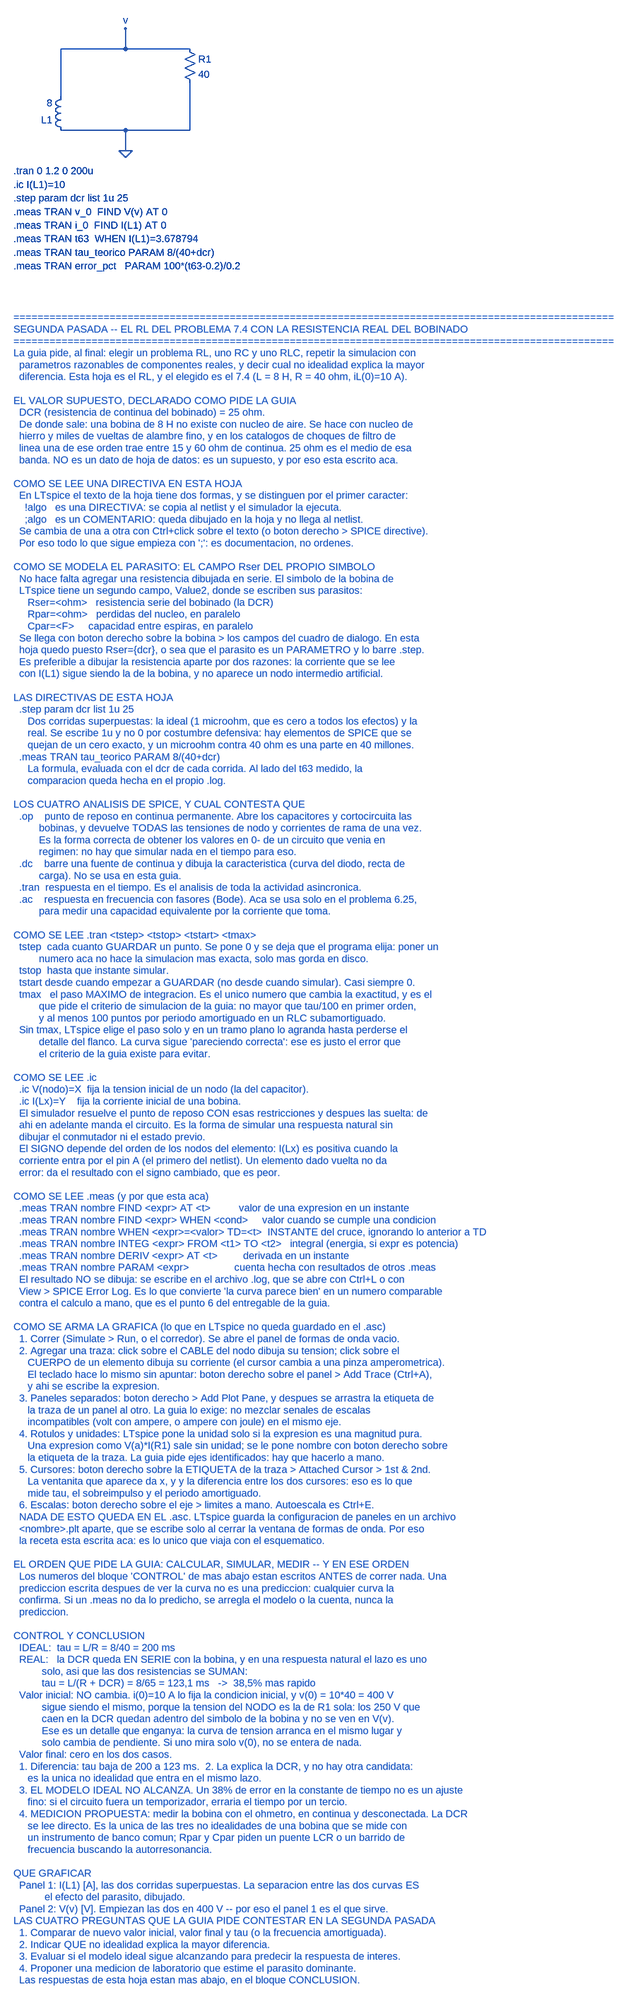
[diagram p0: schematic X1_no_ideal_RL_con_DCR.asc]
X1_no_ideal_RL_con_DCR.asc, the LTspice schematic file:
Version 4
SHEET 1 2200 2800
WIRE 176 224 176 112
WIRE 480 192 480 304
WIRE 176 112 480 112
WIRE 176 304 480 304
WIRE 328 304 328 352
WIRE 328 112 328 64
FLAG 328 352 0
FLAG 328 64 v
SYMBOL ind 192 320 R180
SYMATTR InstName L1
SYMATTR Value 8
SYMATTR Value2 Rser={dcr}
SYMBOL res 464 96 R0
SYMATTR InstName R1
SYMATTR Value 40
TEXT 64 400 Left 2 !.tran 0 1.2 0 200u
TEXT 64 432 Left 2 !.ic I(L1)=10
TEXT 64 464 Left 2 !.step param dcr list 1u 25
TEXT 64 496 Left 2 !.meas TRAN v_0  FIND V(v) AT 0
TEXT 64 528 Left 2 !.meas TRAN i_0  FIND I(L1) AT 0
TEXT 64 560 Left 2 !.meas TRAN t63  WHEN I(L1)=3.678794
TEXT 64 592 Left 2 !.meas TRAN tau_teorico PARAM 8/(40+dcr)
TEXT 64 624 Left 2 !.meas TRAN error_pct   PARAM 100*(t63-0.2)/0.2
TEXT 64 900 Left 2 ;====================================================================================================
TEXT 64 928 Left 2 ;SEGUNDA PASADA -- EL RL DEL PROBLEMA 7.4 CON LA RESISTENCIA REAL DEL BOBINADO
TEXT 64 956 Left 2 ;====================================================================================================
TEXT 64 984 Left 2 ;La guia pide, al final: elegir un problema RL, uno RC y uno RLC, repetir la simulacion con
TEXT 64 1012 Left 2 ;  parametros razonables de componentes reales, y decir cual no idealidad explica la mayor
TEXT 64 1040 Left 2 ;  diferencia. Esta hoja es el RL, y el elegido es el 7.4 (L = 8 H, R = 40 ohm, iL(0)=10 A).
TEXT 64 1068 Left 2 ;
TEXT 64 1096 Left 2 ;EL VALOR SUPUESTO, DECLARADO COMO PIDE LA GUIA
TEXT 64 1124 Left 2 ;  DCR (resistencia de continua del bobinado) = 25 ohm.
TEXT 64 1152 Left 2 ;  De donde sale: una bobina de 8 H no existe con nucleo de aire. Se hace con nucleo de
TEXT 64 1180 Left 2 ;  hierro y miles de vueltas de alambre fino, y en los catalogos de choques de filtro de
TEXT 64 1208 Left 2 ;  linea una de ese orden trae entre 15 y 60 ohm de continua. 25 ohm es el medio de esa
TEXT 64 1236 Left 2 ;  banda. NO es un dato de hoja de datos: es un supuesto, y por eso esta escrito aca.
TEXT 64 1264 Left 2 ;
TEXT 64 1292 Left 2 ;COMO SE LEE UNA DIRECTIVA EN ESTA HOJA
TEXT 64 1320 Left 2 ;  En LTspice el texto de la hoja tiene dos formas, y se distinguen por el primer caracter:
TEXT 64 1348 Left 2 ;    !algo   es una DIRECTIVA: se copia al netlist y el simulador la ejecuta.
TEXT 64 1376 Left 2 ;    ;algo   es un COMENTARIO: queda dibujado en la hoja y no llega al netlist.
TEXT 64 1404 Left 2 ;  Se cambia de una a otra con Ctrl+click sobre el texto (o boton derecho > SPICE directive).
TEXT 64 1432 Left 2 ;  Por eso todo lo que sigue empieza con ';': es documentacion, no ordenes.
TEXT 64 1460 Left 2 ;
TEXT 64 1488 Left 2 ;COMO SE MODELA EL PARASITO: EL CAMPO Rser DEL PROPIO SIMBOLO
TEXT 64 1516 Left 2 ;  No hace falta agregar una resistencia dibujada en serie. El simbolo de la bobina de
TEXT 64 1544 Left 2 ;  LTspice tiene un segundo campo, Value2, donde se escriben sus parasitos:
TEXT 64 1572 Left 2 ;     Rser=<ohm>   resistencia serie del bobinado (la DCR)
TEXT 64 1600 Left 2 ;     Rpar=<ohm>   perdidas del nucleo, en paralelo
TEXT 64 1628 Left 2 ;     Cpar=<F>     capacidad entre espiras, en paralelo
TEXT 64 1656 Left 2 ;  Se llega con boton derecho sobre la bobina > los campos del cuadro de dialogo. En esta
TEXT 64 1684 Left 2 ;  hoja quedo puesto Rser={dcr}, o sea que el parasito es un PARAMETRO y lo barre .step.
TEXT 64 1712 Left 2 ;  Es preferible a dibujar la resistencia aparte por dos razones: la corriente que se lee
TEXT 64 1740 Left 2 ;  con I(L1) sigue siendo la de la bobina, y no aparece un nodo intermedio artificial.
TEXT 64 1768 Left 2 ;
TEXT 64 1796 Left 2 ;LAS DIRECTIVAS DE ESTA HOJA
TEXT 64 1824 Left 2 ;  .step param dcr list 1u 25
TEXT 64 1852 Left 2 ;     Dos corridas superpuestas: la ideal (1 microohm, que es cero a todos los efectos) y la
TEXT 64 1880 Left 2 ;     real. Se escribe 1u y no 0 por costumbre defensiva: hay elementos de SPICE que se
TEXT 64 1908 Left 2 ;     quejan de un cero exacto, y un microohm contra 40 ohm es una parte en 40 millones.
TEXT 64 1936 Left 2 ;  .meas TRAN tau_teorico PARAM 8/(40+dcr)
TEXT 64 1964 Left 2 ;     La formula, evaluada con el dcr de cada corrida. Al lado del t63 medido, la
TEXT 64 1992 Left 2 ;     comparacion queda hecha en el propio .log.
TEXT 64 2020 Left 2 ;
TEXT 64 2048 Left 2 ;LOS CUATRO ANALISIS DE SPICE, Y CUAL CONTESTA QUE
TEXT 64 2076 Left 2 ;  .op    punto de reposo en continua permanente. Abre los capacitores y cortocircuita las
TEXT 64 2104 Left 2 ;         bobinas, y devuelve TODAS las tensiones de nodo y corrientes de rama de una vez.
TEXT 64 2132 Left 2 ;         Es la forma correcta de obtener los valores en 0- de un circuito que venia en
TEXT 64 2160 Left 2 ;         regimen: no hay que simular nada en el tiempo para eso.
TEXT 64 2188 Left 2 ;  .dc    barre una fuente de continua y dibuja la caracteristica (curva del diodo, recta de
TEXT 64 2216 Left 2 ;         carga). No se usa en esta guia.
TEXT 64 2244 Left 2 ;  .tran  respuesta en el tiempo. Es el analisis de toda la actividad asincronica.
TEXT 64 2272 Left 2 ;  .ac    respuesta en frecuencia con fasores (Bode). Aca se usa solo en el problema 6.25,
TEXT 64 2300 Left 2 ;         para medir una capacidad equivalente por la corriente que toma.
TEXT 64 2328 Left 2 ;
TEXT 64 2356 Left 2 ;COMO SE LEE .tran <tstep> <tstop> <tstart> <tmax>
TEXT 64 2384 Left 2 ;  tstep  cada cuanto GUARDAR un punto. Se pone 0 y se deja que el programa elija: poner un
TEXT 64 2412 Left 2 ;         numero aca no hace la simulacion mas exacta, solo mas gorda en disco.
TEXT 64 2440 Left 2 ;  tstop  hasta que instante simular.
TEXT 64 2468 Left 2 ;  tstart desde cuando empezar a GUARDAR (no desde cuando simular). Casi siempre 0.
TEXT 64 2496 Left 2 ;  tmax   el paso MAXIMO de integracion. Es el unico numero que cambia la exactitud, y es el
TEXT 64 2524 Left 2 ;         que pide el criterio de simulacion de la guia: no mayor que tau/100 en primer orden,
TEXT 64 2552 Left 2 ;         y al menos 100 puntos por periodo amortiguado en un RLC subamortiguado.
TEXT 64 2580 Left 2 ;  Sin tmax, LTspice elige el paso solo y en un tramo plano lo agranda hasta perderse el
TEXT 64 2608 Left 2 ;         detalle del flanco. La curva sigue 'pareciendo correcta': ese es justo el error que
TEXT 64 2636 Left 2 ;         el criterio de la guia existe para evitar.
TEXT 64 2664 Left 2 ;
TEXT 64 2692 Left 2 ;COMO SE LEE .ic
TEXT 64 2720 Left 2 ;  .ic V(nodo)=X  fija la tension inicial de un nodo (la del capacitor).
TEXT 64 2748 Left 2 ;  .ic I(Lx)=Y    fija la corriente inicial de una bobina.
TEXT 64 2776 Left 2 ;  El simulador resuelve el punto de reposo CON esas restricciones y despues las suelta: de
TEXT 64 2804 Left 2 ;  ahi en adelante manda el circuito. Es la forma de simular una respuesta natural sin
TEXT 64 2832 Left 2 ;  dibujar el conmutador ni el estado previo.
TEXT 64 2860 Left 2 ;  El SIGNO depende del orden de los nodos del elemento: I(Lx) es positiva cuando la
TEXT 64 2888 Left 2 ;  corriente entra por el pin A (el primero del netlist). Un elemento dado vuelta no da
TEXT 64 2916 Left 2 ;  error: da el resultado con el signo cambiado, que es peor.
TEXT 64 2944 Left 2 ;
TEXT 64 2972 Left 2 ;COMO SE LEE .meas (y por que esta aca)
TEXT 64 3000 Left 2 ;  .meas TRAN nombre FIND <expr> AT <t>          valor de una expresion en un instante
TEXT 64 3028 Left 2 ;  .meas TRAN nombre FIND <expr> WHEN <cond>     valor cuando se cumple una condicion
TEXT 64 3056 Left 2 ;  .meas TRAN nombre WHEN <expr>=<valor> TD=<t>  INSTANTE del cruce, ignorando lo anterior a TD
TEXT 64 3084 Left 2 ;  .meas TRAN nombre INTEG <expr> FROM <t1> TO <t2>   integral (energia, si expr es potencia)
TEXT 64 3112 Left 2 ;  .meas TRAN nombre DERIV <expr> AT <t>         derivada en un instante
TEXT 64 3140 Left 2 ;  .meas TRAN nombre PARAM <expr>                cuenta hecha con resultados de otros .meas
TEXT 64 3168 Left 2 ;  El resultado NO se dibuja: se escribe en el archivo .log, que se abre con Ctrl+L o con
TEXT 64 3196 Left 2 ;  View > SPICE Error Log. Es lo que convierte 'la curva parece bien' en un numero comparable
TEXT 64 3224 Left 2 ;  contra el calculo a mano, que es el punto 6 del entregable de la guia.
TEXT 64 3252 Left 2 ;
TEXT 64 3280 Left 2 ;COMO SE ARMA LA GRAFICA (lo que en LTspice no queda guardado en el .asc)
TEXT 64 3308 Left 2 ;  1. Correr (Simulate > Run, o el corredor). Se abre el panel de formas de onda vacio.
TEXT 64 3336 Left 2 ;  2. Agregar una traza: click sobre el CABLE del nodo dibuja su tension; click sobre el
TEXT 64 3364 Left 2 ;     CUERPO de un elemento dibuja su corriente (el cursor cambia a una pinza amperometrica).
TEXT 64 3392 Left 2 ;     El teclado hace lo mismo sin apuntar: boton derecho sobre el panel > Add Trace (Ctrl+A),
TEXT 64 3420 Left 2 ;     y ahi se escribe la expresion.
TEXT 64 3448 Left 2 ;  3. Paneles separados: boton derecho > Add Plot Pane, y despues se arrastra la etiqueta de
TEXT 64 3476 Left 2 ;     la traza de un panel al otro. La guia lo exige: no mezclar senales de escalas
TEXT 64 3504 Left 2 ;     incompatibles (volt con ampere, o ampere con joule) en el mismo eje.
TEXT 64 3532 Left 2 ;  4. Rotulos y unidades: LTspice pone la unidad solo si la expresion es una magnitud pura.
TEXT 64 3560 Left 2 ;     Una expresion como V(a)*I(R1) sale sin unidad; se le pone nombre con boton derecho sobre
TEXT 64 3588 Left 2 ;     la etiqueta de la traza. La guia pide ejes identificados: hay que hacerlo a mano.
TEXT 64 3616 Left 2 ;  5. Cursores: boton derecho sobre la ETIQUETA de la traza > Attached Cursor > 1st & 2nd.
TEXT 64 3644 Left 2 ;     La ventanita que aparece da x, y y la diferencia entre los dos cursores: eso es lo que
TEXT 64 3672 Left 2 ;     mide tau, el sobreimpulso y el periodo amortiguado.
TEXT 64 3700 Left 2 ;  6. Escalas: boton derecho sobre el eje > limites a mano. Autoescala es Ctrl+E.
TEXT 64 3728 Left 2 ;  NADA DE ESTO QUEDA EN EL .asc. LTspice guarda la configuracion de paneles en un archivo
TEXT 64 3756 Left 2 ;  <nombre>.plt aparte, que se escribe solo al cerrar la ventana de formas de onda. Por eso
TEXT 64 3784 Left 2 ;  la receta esta escrita aca: es lo unico que viaja con el esquematico.
TEXT 64 3812 Left 2 ;
TEXT 64 3840 Left 2 ;EL ORDEN QUE PIDE LA GUIA: CALCULAR, SIMULAR, MEDIR -- Y EN ESE ORDEN
TEXT 64 3868 Left 2 ;  Los numeros del bloque 'CONTROL' de mas abajo estan escritos ANTES de correr nada. Una
TEXT 64 3896 Left 2 ;  prediccion escrita despues de ver la curva no es una prediccion: cualquier curva la
TEXT 64 3924 Left 2 ;  confirma. Si un .meas no da lo predicho, se arregla el modelo o la cuenta, nunca la
TEXT 64 3952 Left 2 ;  prediccion.
TEXT 64 3980 Left 2 ;
TEXT 64 4008 Left 2 ;CONTROL Y CONCLUSION
TEXT 64 4036 Left 2 ;  IDEAL:  tau = L/R = 8/40 = 200 ms
TEXT 64 4064 Left 2 ;  REAL:   la DCR queda EN SERIE con la bobina, y en una respuesta natural el lazo es uno
TEXT 64 4092 Left 2 ;          solo, asi que las dos resistencias se SUMAN:
TEXT 64 4120 Left 2 ;          tau = L/(R + DCR) = 8/65 = 123,1 ms   ->  38,5% mas rapido
TEXT 64 4148 Left 2 ;  Valor inicial: NO cambia. i(0)=10 A lo fija la condicion inicial, y v(0) = 10*40 = 400 V
TEXT 64 4176 Left 2 ;          sigue siendo el mismo, porque la tension del NODO es la de R1 sola: los 250 V que
TEXT 64 4204 Left 2 ;          caen en la DCR quedan adentro del simbolo de la bobina y no se ven en V(v).
TEXT 64 4232 Left 2 ;          Ese es un detalle que enganya: la curva de tension arranca en el mismo lugar y
TEXT 64 4260 Left 2 ;          solo cambia de pendiente. Si uno mira solo v(0), no se entera de nada.
TEXT 64 4288 Left 2 ;  Valor final: cero en los dos casos.
TEXT 64 4316 Left 2 ;  1. Diferencia: tau baja de 200 a 123 ms.  2. La explica la DCR, y no hay otra candidata:
TEXT 64 4344 Left 2 ;     es la unica no idealidad que entra en el mismo lazo.
TEXT 64 4372 Left 2 ;  3. EL MODELO IDEAL NO ALCANZA. Un 38% de error en la constante de tiempo no es un ajuste
TEXT 64 4400 Left 2 ;     fino: si el circuito fuera un temporizador, erraria el tiempo por un tercio.
TEXT 64 4428 Left 2 ;  4. MEDICION PROPUESTA: medir la bobina con el ohmetro, en continua y desconectada. La DCR
TEXT 64 4456 Left 2 ;     se lee directo. Es la unica de las tres no idealidades de una bobina que se mide con
TEXT 64 4484 Left 2 ;     un instrumento de banco comun; Rpar y Cpar piden un puente LCR o un barrido de
TEXT 64 4512 Left 2 ;     frecuencia buscando la autorresonancia.
TEXT 64 4540 Left 2 ;
TEXT 64 4568 Left 2 ;QUE GRAFICAR
TEXT 64 4596 Left 2 ;  Panel 1: I(L1) [A], las dos corridas superpuestas. La separacion entre las dos curvas ES
TEXT 64 4624 Left 2 ;           el efecto del parasito, dibujado.
TEXT 64 4652 Left 2 ;  Panel 2: V(v) [V]. Empiezan las dos en 400 V -- por eso el panel 1 es el que sirve.
TEXT 64 4680 Left 2 ;LAS CUATRO PREGUNTAS QUE LA GUIA PIDE CONTESTAR EN LA SEGUNDA PASADA
TEXT 64 4708 Left 2 ;  1. Comparar de nuevo valor inicial, valor final y tau (o la frecuencia amortiguada).
TEXT 64 4736 Left 2 ;  2. Indicar QUE no idealidad explica la mayor diferencia.
TEXT 64 4764 Left 2 ;  3. Evaluar si el modelo ideal sigue alcanzando para predecir la respuesta de interes.
TEXT 64 4792 Left 2 ;  4. Proponer una medicion de laboratorio que estime el parasito dominante.
TEXT 64 4820 Left 2 ;  Las respuestas de esta hoja estan mas abajo, en el bloque CONCLUSION.

The netlist it stands for:
* X1_no_ideal_RL_con_DCR.asc
L1 0 v 8 Rser={dcr}
R1 v 0 40
.tran 0 1.2 0 200u
.ic I(L1)=10
.step param dcr list 1u 25
.meas TRAN v_0  FIND V(v) AT 0
.meas TRAN i_0  FIND I(L1) AT 0
.meas TRAN t63  WHEN I(L1)=3.678794
.meas TRAN tau_teorico PARAM 8/(40+dcr)
.meas TRAN error_pct   PARAM 100*(t63-0.2)/0.2
* ====================================================================================================
* SEGUNDA PASADA -- EL RL DEL PROBLEMA 7.4 CON LA RESISTENCIA REAL DEL BOBINADO
* ====================================================================================================
* La guia pide, al final: elegir un problema RL, uno RC y uno RLC, repetir la simulacion con
*   parametros razonables de componentes reales, y decir cual no idealidad explica la mayor
*   diferencia. Esta hoja es el RL, y el elegido es el 7.4 (L = 8 H, R = 40 ohm, iL(0)=10 A).
* EL VALOR SUPUESTO, DECLARADO COMO PIDE LA GUIA
*   DCR (resistencia de continua del bobinado) = 25 ohm.
*   De donde sale: una bobina de 8 H no existe con nucleo de aire. Se hace con nucleo de
*   hierro y miles de vueltas de alambre fino, y en los catalogos de choques de filtro de
*   linea una de ese orden trae entre 15 y 60 ohm de continua. 25 ohm es el medio de esa
*   banda. NO es un dato de hoja de datos: es un supuesto, y por eso esta escrito aca.
* COMO SE LEE UNA DIRECTIVA EN ESTA HOJA
*   En LTspice el texto de la hoja tiene dos formas, y se distinguen por el primer caracter:
*     !algo   es una DIRECTIVA: se copia al netlist y el simulador la ejecuta.
*     ;algo   es un COMENTARIO: queda dibujado en la hoja y no llega al netlist.
*   Se cambia de una a otra con Ctrl+click sobre el texto (o boton derecho > SPICE directive).
*   Por eso todo lo que sigue empieza con ';': es documentacion, no ordenes.
* COMO SE MODELA EL PARASITO: EL CAMPO Rser DEL PROPIO SIMBOLO
*   No hace falta agregar una resistencia dibujada en serie. El simbolo de la bobina de
*   LTspice tiene un segundo campo, Value2, donde se escriben sus parasitos:
*      Rser=<ohm>   resistencia serie del bobinado (la DCR)
*      Rpar=<ohm>   perdidas del nucleo, en paralelo
*      Cpar=<F>     capacidad entre espiras, en paralelo
*   Se llega con boton derecho sobre la bobina > los campos del cuadro de dialogo. En esta
*   hoja quedo puesto Rser={dcr}, o sea que el parasito es un PARAMETRO y lo barre .step.
*   Es preferible a dibujar la resistencia aparte por dos razones: la corriente que se lee
*   con I(L1) sigue siendo la de la bobina, y no aparece un nodo intermedio artificial.
* LAS DIRECTIVAS DE ESTA HOJA
*   .step param dcr list 1u 25
*      Dos corridas superpuestas: la ideal (1 microohm, que es cero a todos los efectos) y la
*      real. Se escribe 1u y no 0 por costumbre defensiva: hay elementos de SPICE que se
*      quejan de un cero exacto, y un microohm contra 40 ohm es una parte en 40 millones.
*   .meas TRAN tau_teorico PARAM 8/(40+dcr)
*      La formula, evaluada con el dcr de cada corrida. Al lado del t63 medido, la
*      comparacion queda hecha en el propio .log.
* LOS CUATRO ANALISIS DE SPICE, Y CUAL CONTESTA QUE
*   .op    punto de reposo en continua permanente. Abre los capacitores y cortocircuita las
*          bobinas, y devuelve TODAS las tensiones de nodo y corrientes de rama de una vez.
*          Es la forma correcta de obtener los valores en 0- de un circuito que venia en
*          regimen: no hay que simular nada en el tiempo para eso.
*   .dc    barre una fuente de continua y dibuja la caracteristica (curva del diodo, recta de
*          carga). No se usa en esta guia.
*   .tran  respuesta en el tiempo. Es el analisis de toda la actividad asincronica.
*   .ac    respuesta en frecuencia con fasores (Bode). Aca se usa solo en el problema 6.25,
*          para medir una capacidad equivalente por la corriente que toma.
* COMO SE LEE .tran <tstep> <tstop> <tstart> <tmax>
*   tstep  cada cuanto GUARDAR un punto. Se pone 0 y se deja que el programa elija: poner un
*          numero aca no hace la simulacion mas exacta, solo mas gorda en disco.
*   tstop  hasta que instante simular.
*   tstart desde cuando empezar a GUARDAR (no desde cuando simular). Casi siempre 0.
*   tmax   el paso MAXIMO de integracion. Es el unico numero que cambia la exactitud, y es el
*          que pide el criterio de simulacion de la guia: no mayor que tau/100 en primer orden,
*          y al menos 100 puntos por periodo amortiguado en un RLC subamortiguado.
*   Sin tmax, LTspice elige el paso solo y en un tramo plano lo agranda hasta perderse el
*          detalle del flanco. La curva sigue 'pareciendo correcta': ese es justo el error que
*          el criterio de la guia existe para evitar.
* COMO SE LEE .ic
*   .ic V(nodo)=X  fija la tension inicial de un nodo (la del capacitor).
*   .ic I(Lx)=Y    fija la corriente inicial de una bobina.
*   El simulador resuelve el punto de reposo CON esas restricciones y despues las suelta: de
*   ahi en adelante manda el circuito. Es la forma de simular una respuesta natural sin
*   dibujar el conmutador ni el estado previo.
*   El SIGNO depende del orden de los nodos del elemento: I(Lx) es positiva cuando la
*   corriente entra por el pin A (el primero del netlist). Un elemento dado vuelta no da
*   error: da el resultado con el signo cambiado, que es peor.
* COMO SE LEE .meas (y por que esta aca)
*   .meas TRAN nombre FIND <expr> AT <t>          valor de una expresion en un instante
*   .meas TRAN nombre FIND <expr> WHEN <cond>     valor cuando se cumple una condicion
*   .meas TRAN nombre WHEN <expr>=<valor> TD=<t>  INSTANTE del cruce, ignorando lo anterior a TD
*   .meas TRAN nombre INTEG <expr> FROM <t1> TO <t2>   integral (energia, si expr es potencia)
*   .meas TRAN nombre DERIV <expr> AT <t>         derivada en un instante
*   .meas TRAN nombre PARAM <expr>                cuenta hecha con resultados de otros .meas
*   El resultado NO se dibuja: se escribe en el archivo .log, que se abre con Ctrl+L o con
*   View > SPICE Error Log. Es lo que convierte 'la curva parece bien' en un numero comparable
*   contra el calculo a mano, que es el punto 6 del entregable de la guia.
* COMO SE ARMA LA GRAFICA (lo que en LTspice no queda guardado en el .asc)
*   1. Correr (Simulate > Run, o el corredor). Se abre el panel de formas de onda vacio.
*   2. Agregar una traza: click sobre el CABLE del nodo dibuja su tension; click sobre el
*      CUERPO de un elemento dibuja su corriente (el cursor cambia a una pinza amperometrica).
*      El teclado hace lo mismo sin apuntar: boton derecho sobre el panel > Add Trace (Ctrl+A),
*      y ahi se escribe la expresion.
*   3. Paneles separados: boton derecho > Add Plot Pane, y despues se arrastra la etiqueta de
*      la traza de un panel al otro. La guia lo exige: no mezclar senales de escalas
*      incompatibles (volt con ampere, o ampere con joule) en el mismo eje.
*   4. Rotulos y unidades: LTspice pone la unidad solo si la expresion es una magnitud pura.
*      Una expresion como V(a)*I(R1) sale sin unidad; se le pone nombre con boton derecho sobre
*      la etiqueta de la traza. La guia pide ejes identificados: hay que hacerlo a mano.
*   5. Cursores: boton derecho sobre la ETIQUETA de la traza > Attached Cursor > 1st & 2nd.
*      La ventanita que aparece da x, y y la diferencia entre los dos cursores: eso es lo que
*      mide tau, el sobreimpulso y el periodo amortiguado.
*   6. Escalas: boton derecho sobre el eje > limites a mano. Autoescala es Ctrl+E.
*   NADA DE ESTO QUEDA EN EL .asc. LTspice guarda la configuracion de paneles en un archivo
*   <nombre>.plt aparte, que se escribe solo al cerrar la ventana de formas de onda. Por eso
*   la receta esta escrita aca: es lo unico que viaja con el esquematico.
* EL ORDEN QUE PIDE LA GUIA: CALCULAR, SIMULAR, MEDIR -- Y EN ESE ORDEN
*   Los numeros del bloque 'CONTROL' de mas abajo estan escritos ANTES de correr nada. Una
*   prediccion escrita despues de ver la curva no es una prediccion: cualquier curva la
*   confirma. Si un .meas no da lo predicho, se arregla el modelo o la cuenta, nunca la
*   prediccion.
* CONTROL Y CONCLUSION
*   IDEAL:  tau = L/R = 8/40 = 200 ms
*   REAL:   la DCR queda EN SERIE con la bobina, y en una respuesta natural el lazo es uno
*           solo, asi que las dos resistencias se SUMAN:
*           tau = L/(R + DCR) = 8/65 = 123,1 ms   ->  38,5% mas rapido
*   Valor inicial: NO cambia. i(0)=10 A lo fija la condicion inicial, y v(0) = 10*40 = 400 V
*           sigue siendo el mismo, porque la tension del NODO es la de R1 sola: los 250 V que
*           caen en la DCR quedan adentro del simbolo de la bobina y no se ven en V(v).
*           Ese es un detalle que enganya: la curva de tension arranca en el mismo lugar y
*           solo cambia de pendiente. Si uno mira solo v(0), no se entera de nada.
*   Valor final: cero en los dos casos.
*   1. Diferencia: tau baja de 200 a 123 ms.  2. La explica la DCR, y no hay otra candidata:
*      es la unica no idealidad que entra en el mismo lazo.
*   3. EL MODELO IDEAL NO ALCANZA. Un 38% de error en la constante de tiempo no es un ajuste
*      fino: si el circuito fuera un temporizador, erraria el tiempo por un tercio.
*   4. MEDICION PROPUESTA: medir la bobina con el ohmetro, en continua y desconectada. La DCR
*      se lee directo. Es la unica de las tres no idealidades de una bobina que se mide con
*      un instrumento de banco comun; Rpar y Cpar piden un puente LCR o un barrido de
*      frecuencia buscando la autorresonancia.
* QUE GRAFICAR
*   Panel 1: I(L1) [A], las dos corridas superpuestas. La separacion entre las dos curvas ES
*            el efecto del parasito, dibujado.
*   Panel 2: V(v) [V]. Empiezan las dos en 400 V -- por eso el panel 1 es el que sirve.
* LAS CUATRO PREGUNTAS QUE LA GUIA PIDE CONTESTAR EN LA SEGUNDA PASADA
*   1. Comparar de nuevo valor inicial, valor final y tau (o la frecuencia amortiguada).
*   2. Indicar QUE no idealidad explica la mayor diferencia.
*   3. Evaluar si el modelo ideal sigue alcanzando para predecir la respuesta de interes.
*   4. Proponer una medicion de laboratorio que estime el parasito dominante.
*   Las respuestas de esta hoja estan mas abajo, en el bloque CONCLUSION.
.backanno
.end